# EAGLE design sparrow-though-jack (EAGLE 6.1)
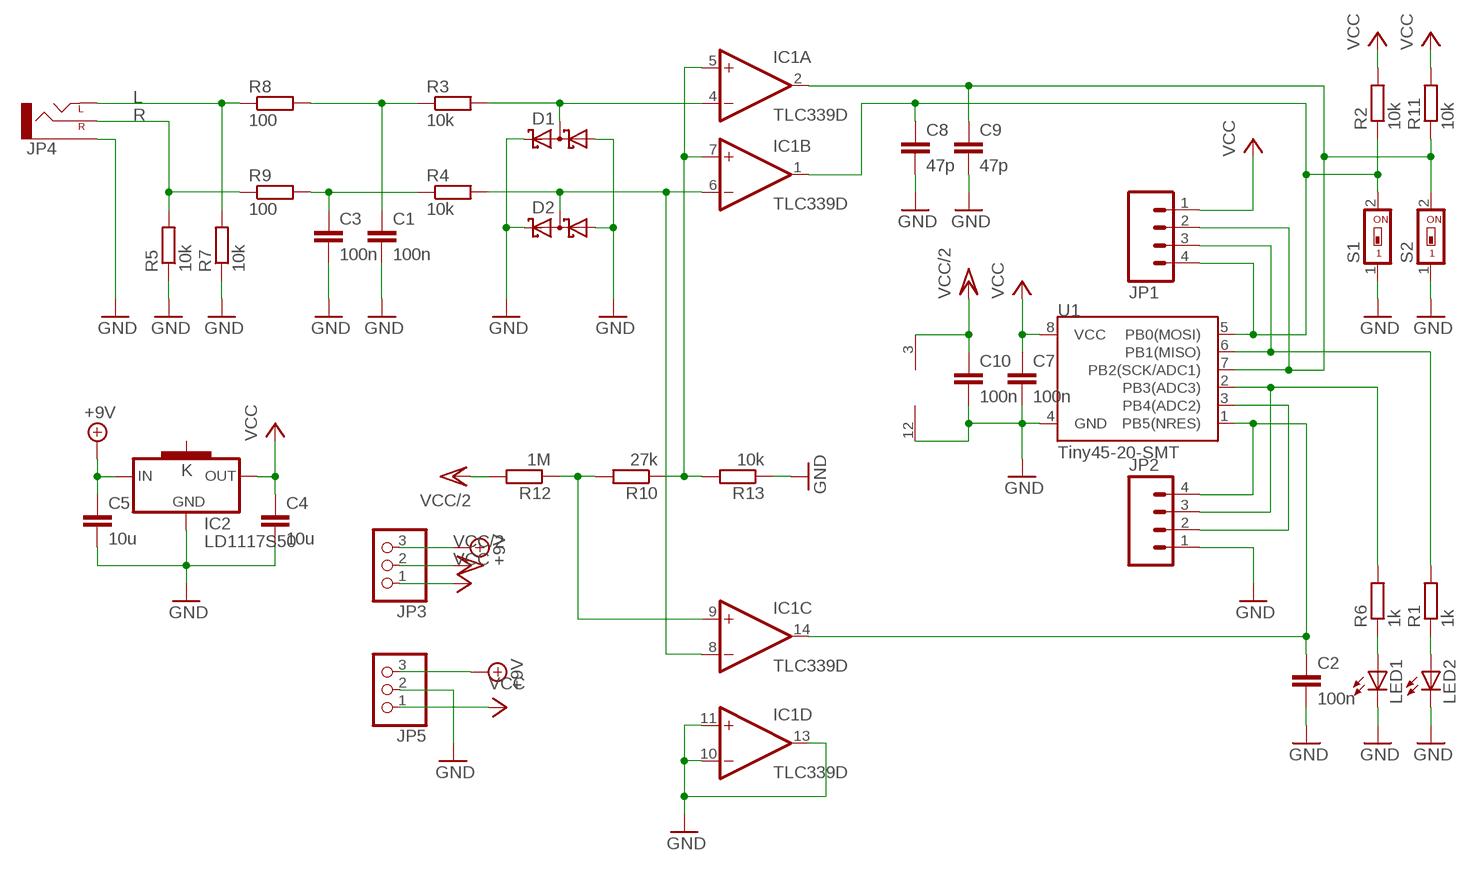
[diagram p0: schematic, sheet 1]

## Parts
C1  100n  C-EUC0805K  [C0805K]
C2  100n  C-EUC0805K  [C0805K]
C3  100n  C-EUC0805K  [C0805K]
C4  10u  C-EUC0805K  [C0805K]
C5  10u  C-EUC0805K  [C0805K]
C7  100n  C-EUC0805K  [C0805K]
C8  47p  C-EUC0805K  [C0805K]
C9  47p  C-EUC0805K  [C0805K]
C10  100n  C-EUC0805K  [C0805K]
D1  BAT54S  [SOT23]
D2  BAT54S  [SOT23]
IC1  TLC339D  [SO14]
IC2  LD1117S50  [SOT223]
JP1  M04PTH  [1X04]
JP2  M04PTH  [1X04]
JP3  PINHD-1X3  [1X03]
JP4  AUDIO-JACKPIN-HOLES  [AUDIO-JACK-HOLES]
JP5  PINHD-1X3  [1X03]
LED1  LEDCHIP-LED0805  [CHIP-LED0805]
LED2  LEDCHIP-LED0805  [CHIP-LED0805]
R1  1k  R-EU_M0805  [M0805]
R2  10k  R-EU_M0805  [M0805]
R3  10k  R-EU_M0805  [M0805]
R4  10k  R-EU_M0805  [M0805]
R5  10k  R-EU_M0805  [M0805]
R6  1k  R-EU_M0805  [M0805]
R7  10k  R-EU_M0805  [M0805]
R8  100  R-EU_M0805  [M0805]
R9  100  R-EU_M0805  [M0805]
R10  27k  R-EU_M0805  [M0805]
R11  10k  R-EU_M0805  [M0805]
R12  1M  R-EU_M0805  [M0805]
R13  10k  R-EU_M0805  [M0805]
S1  SWS001  [SMS-001]
S2  SWS001  [SMS-001]
U1  Tiny45-20-SMT  ATTINY45TINY45-20-SMT  [SO08-EIAJ]

## Nets
+9V: C5.1 IC2.3(IN) JP3.3 JP5.3
GND: C1.2 C2.2 C3.2 C4.2 C5.2 C7.2 C8.2 C9.2 C10.2 D1.1(A1) D1.2(C2) D2.1(A1) D2.2(C2) IC1.10(D:-IN) IC1.11(D:+IN) IC1.12(P:V-) IC1.13(D:OUT) IC2.1(GND) JP2.1 JP4.GND(SLEEVE) JP5.2 LED1.C LED2.C R5.1 R7.1 R13.1 S1.1 S2.1 U1.4(GND)
L: JP4.L1-(LEFT) JP4.L2-(LEFT) R7.2 R8.1
N$1: D1.3(C1A2) IC1.4(A:-IN) R3.2
N$2: JP2.3 R6.2 U1.2(PB3(ADC3))
N$3: C2.1 IC1.14(C:OUT) JP2.4 U1.1(PB5(NRES))
N$4: JP2.2 U1.3(PB4(ADC2))
N$6: D2.3(C1A2) IC1.6(B:-IN) IC1.8(C:-IN) R4.2
N$7: JP1.3 R1.2 U1.6(PB1(MISO))
N$8: C9.1 IC1.2(A:OUT) JP1.2 R11.1 S2.2 U1.7(PB2(SCK/ADC1))
N$9: C1.1 R3.1 R8.2
N$10: LED1.A R6.1
N$11: LED2.A R1.1
N$12: C3.1 R4.1 R9.2
N$13: C8.1 IC1.1(B:OUT) JP1.4 R2.1 S1.2 U1.5(PB0(MOSI))
N$16: IC1.9(C:+IN) R10.2 R12.1
N$17: IC1.5(A:+IN) IC1.7(B:+IN) R10.1 R13.2
R: JP4.R+(RIGHT) R5.2 R9.1
VCC: C4.1 C7.1 IC2.2(OUT) JP1.1 JP3.1 JP5.1 R2.2 R11.2 U1.8(VCC)
VCC/2: C10.1 IC1.3(P:V+) JP3.2 R12.2
Unconnected: IC2.4(K)

## Library data of the parts
C1-C5 C7-C10 = rcl:C-EU: CAPACITOR, European symbol
D1 D2 = diode:BAT54S: Schottky Diodes Pin connection corrected 2011-05-04 Source: Fairchild .. BAT54.pdf
IC1 = linear:TLC339: COMPARATOR
IC2 = mbed-ics:LD1117S50: VOLTAGE REGULATOR SMD 5V
JP1 JP2 = SparkFun-Connectors:M04: Header 4 Standard 4-pin 0.1" header. Use with straight break away headers (SKU : PRT-00116), right angle break away headers (PRT-00553), swiss pins (PRT-00743), machine pins (PRT-00117), and female headers (PRT-00115). Molex polarized connector foot print use with SKU : PRT-08231 with associated crimp pins and housings. 1MM SMD Version SKU: PRT-10208
JP3 JP5 = pinhead:PINHD-1X3: PIN HEADER
JP4 = _MY_OWN_LIB:AUDIO-JACK: 3.5mm Audio Jack Simple 3.5mm common PCB mount audio jack. SKU: PRT-08032
LED1 LED2 = led:LED: LED OSRAM: - CHIPLED LG R971, LG N971, LY N971, LG Q971, LY Q971, LO R971, LY R971 LH N974, LH R974 LS Q976, LO Q976, LY Q976 LO Q996 - Hyper CHIPLED LW Q18S LB Q993, LB Q99A, LB R99A - SideLED LS A670, LO A670, LY A670, LG A670, LP A670 LB A673, LV A673, LT A673, LW A673 LH A674 LY A675 LS A676, LA A676, LO A676, LY A676, LW A676 LS A679, LY A679, LG A679 - Hyper Micro SIDELED® LS Y876, LA Y876, LO Y876, LY Y876 LT Y87S - SmartLED LW L88C, LW L88S LB L89C, LB L89S, LG L890 LS L89K, LO L89K, LY L89K LS L896, LA L896, LO L896, LY L896 - TOPLED LS T670, LO T670, LY T670, LG T670, LP T670 LSG T670, LSP T670, LSY T670, LOP T670, LYG T670 LG T671, LOG T671, LSG T671 LB T673, LV T673, LT T673, LW T673 LH T674 LS T676, LA T676, LO T676, LY T676, LB T676, LH T676, LSB T676, LW T676 LB T67C, LV T67C, LT T67C, LS T67K, LO T67K, LY T67K, LW E67C LS E67B, LA E67B, LO E67B, LY E67B, LB E67C, LV E67C, LT E67C LW T67C LS T679, LY T679, LG T679 LS T770, LO T770, LY T770, LG T770, LP T770 LB T773, LV T773, LT T773, LW T773 LH T774 LS E675, LA E675, LY E675, LS T675 LS T776, LA T776, LO T776, LY T776, LB T776 LHGB T686 LT T68C, LB T68C - Hyper Mini TOPLED® LB M676 - Mini TOPLED Santana® LG M470 LS M47K, LO M47K, LY M47K Source: http://www.osram.convergy.de LUXEON: - LUMILED® LXK2-PW12-R00, LXK2-PW12-S00, LXK2-PW14-U00, LXK2-PW14-V00 LXK2-PM12-R00, LXK2-PM12-S00, LXK2-PM14-U00 LXK2-PE12-Q00, LXK2-PE12-R00, LXK2-PE12-S00, LXK2-PE14-T00, LXK2-PE14-U00 LXK2-PB12-K00, LXK2-PB12-L00, LXK2-PB12-M00, LXK2-PB14-N00, LXK2-PB14-P00, LXK2-PB14-Q00 LXK2-PR12-L00, LXK2-PR12-M00, LXK2-PR14-Q00, LXK2-PR14-R00 LXK2-PD12-Q00, LXK2-PD12-R00, LXK2-PD12-S00 LXK2-PH12-R00, LXK2-PH12-S00 LXK2-PL12-P00, LXK2-PL12-Q00, LXK2-PL12-R00 Source: www.luxeon.com KINGBRIGHT: KA-3528ASYC Source: www.kingbright.com
R1-R13 = rcl:R-EU_: RESISTOR, European symbol
S1 S2 = smd-special:SWS001: SMD Dip Switch 1 pol.
U1 = SparkFun-DigitalIC:ATTINY45: Atmel 8-pin 2/4/8kB flash uC; PROD_ID: IC-08922

## Board
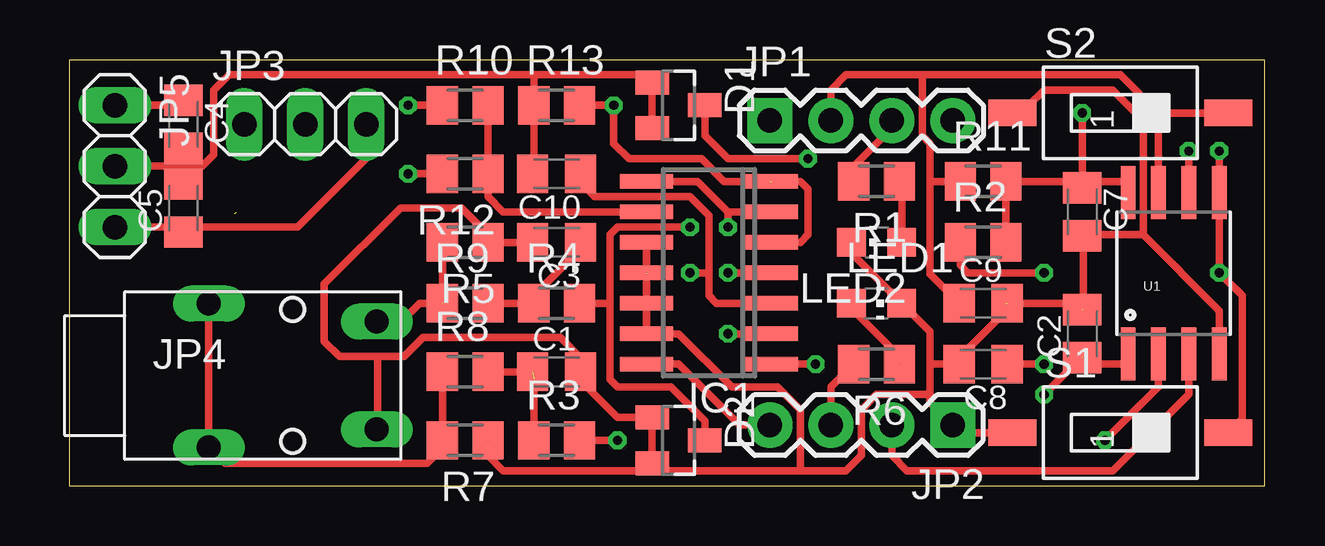
[diagram p1: board, top side]
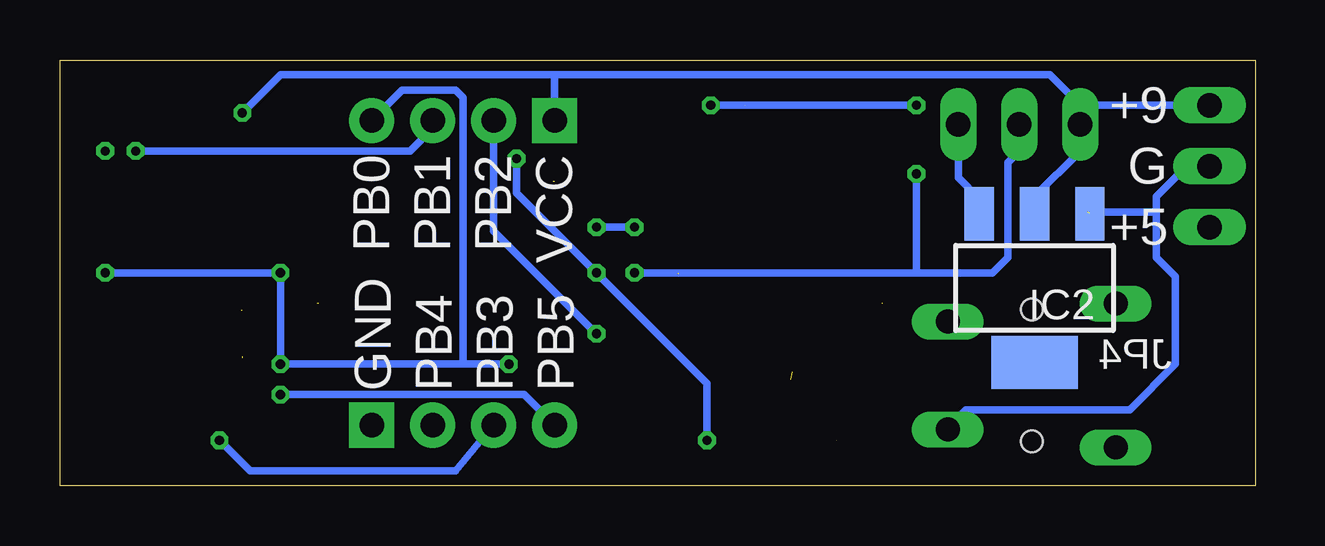
[diagram p2: board, bottom side, seen from below]

Size 49.83 x 17.77 mm. Coordinates in mm from the lower left corner, seen from the top.
Outline: 0,0 49.83,0 49.83,17.77 0,17.77 0,0
Copper layers (1*16): Top 0.0356mm / dielectric 1.5011mm / Bottom 0.0356mm
Design rules: minimum track width 6mil, minimum drill 13mil, track to track 6mil, track to pad 6mil, pad to pad 6mil, via to via 6mil, smd to smd 6mil, copper to edge 15mil, drill to drill 6mil, minimum pad ring 7mil, minimum via ring 7mil, stop-mask expansion 3mil, vias tented up to drill 0mil, thermal gap 10mil

### Footprints (pad centres in the part's own frame; a part is rotated, then mirrored left to right if it is on the bottom)
C0805K = smd 1.3 x 1.6: 1 -1,0; 2 1,0
SOT23 = smd 1 x 1.4: 1 -0.95,-1.1; 2 0.95,-1.1; 3 0,1.1
SO14 = smd 0.6 x 2.2: 1 -3.81,-2.6; 2 -2.54,-2.6; 3 -1.27,-2.6; 4 0,-2.6; 5 1.27,-2.6; 6 2.54,-2.6; 7 3.81,-2.6; 8 3.81,2.6; 9 2.54,2.6; 10 1.27,2.6; 11 0,2.6; 12 -1.27,2.6; 13 -2.54,2.6; 14 -3.81,2.6
SOT223 = smd 1.219 x 2.235: 1 -2.311,-3.099; 2 0,-3.099; 3 2.311,-3.099 | smd 3.6 x 2.2: 4 0,3.099
1X04 = drill 1.016 pad 1.88 square: 1 0,0 | drill 1.016 pad 1.88: 2 2.54,0; 3 5.08,0; 4 7.62,0
1X03 = drill 1.016 long: 1 -2.54,0; 2 0,0; 3 2.54,0
AUDIO-JACK-HOLES = drill 1 pad 1.32 long: GND 6,-2.25; L1- -1,-3; L2- -1,3; R+ 6,2.25 | hole 0.9: 2.5,2.75; 2.5,-2.75
CHIP-LED0805 = smd 1.2 x 1.2: A 0,-1.05; C 0,1.05
M0805 = smd 1.3 x 1.6: 1 -0.95,0; 2 0.95,0
SMS-001 = smd 1.092 x 2.007: 1 0,-4.496; 2 0,4.496
SO08-EIAJ = smd 0.61 x 2.21: 1 -1.905,-3.378; 2 -0.635,-3.378; 3 0.635,-3.378; 4 1.905,-3.378; 5 1.905,3.353; 6 0.635,3.353; 7 -0.635,3.353; 8 -1.905,3.353

### Placement (x,y rotation side)
C1  20.32,4.76 0 top
C2  42.23,6.35 90 top
C3  20.32,10.16 180 top
C4  4.76,15.08 270 top
C5  4.76,11.59 90 top
C7  42.23,11.43 270 top
C8  38.1,5.08 180 top
C9  38.1,7.62 0 top
C10  20.32,13.02 180 top
D1  25.4,15.88 270 top
D2  25.4,1.91 270 top
IC1  26.67,8.89 90 top
IC2  9.21,8.26 180 bottom
JP1  29.21,15.24 0 top
JP2  36.83,2.54 180 top
JP3  9.84,15.08 0 top
JP4  6.83,4.6 0 top
JP5  1.91,13.34 270 top
LED1  33.66,7.62 270 top
LED2  33.66,10.16 90 top
R1  33.66,12.7 180 top
R2  38.1,10.16 0 top
R3  20.32,1.91 0 top
R4  20.32,7.62 0 top
R5  16.51,10.16 180 top
R6  33.66,5.08 180 top
R7  16.51,1.91 180 top
R8  16.51,4.76 0 top
R9  16.51,7.62 0 top
R10  16.51,15.88 0 top
R11  38.1,12.7 0 top
R12  16.51,13.02 180 top
R13  20.32,15.88 0 top
S1  43.82,2.22 270 top
S2  43.82,15.56 270 top
U1  46.04,8.89 0 top

### Tracks (layer width: path | path; a pad name or v marks a point on that pad's centre or on a via)
+9V
  Top 0.305: JP5.3 4.13,10.79 4.13,10.75 C5.1 4.45,10.79 9.53,10.79 12.38,13.65 JP3.3
  Bottom 0.305: IC2.3 11.52,11.99 12.38,12.86 JP3.3
GND  (5 unrouted)
  Top 0.305: S2.1 40.01,15.88 40.64,16.51 43.5,16.51 44.77,15.24 44.77,10.48 | 44.77,10.48 47.94,7.3 U1.4 | 35.88,3.81 33.65,3.81 33.02,3.17 33.02,1.27 32.38,0.64 30.48,0.64 | 35.88,5.08 35.88,6.45 LED1.C 32.8,9.53 LED2.C | 35.88,5.08 35.88,3.81 | C7.2 42.27,10.43 | 35.88,5.08 C8.2 37.42,5.62 37.42,5.67 39.05,7.3 39.05,7.62 | 42.27,7.62 C9.2 | 42.27,10.43 42.27,10.48 44.77,10.48 | 42.27,10.43 42.27,7.62 | 42.27,7.62 42.27,7.35 42.23,7.3 | 21.27,5.03 C1.2 | R7.1 | R5.1 | 24.13,15.24 24.3,15.07 D1.2 D1.1 23.98,17.14 13.97,17.14 | 19.37,13.34 19.37,12.75 C10.2 19.37,13.07 R13.1 19.37,17.14 13.97,17.14 | C3.2 R5.1 | R5.1 17.46,10.48 16.35,11.59 13.81,11.59 10.64,8.41 10.64,6.03 11.27,5.4 12.86,5.4 | 13.97,17.14 6.67,17.14 6.03,16.51 6.03,13.81 5.56,13.34 4.76,13.34 | 4.45,12.38 C5.2 4.76,13.34 | JP5.2 4.76,13.34 | 35.88,3.81 35.88,3.49 JP2.1 37.15,2.22 S1.1 | C1.2 21.32,5.35 20.48,6.19 14.76,6.19 13.97,5.4 12.86,5.4 | C1.2 21.32,4.4 22.86,2.86 24.13,2.86 24.13,2.85 D2.1 D2.2 24.3,0.81 24.13,0.64 | 30.48,0.64 24.13,0.64 | 24.13,0.64 18.1,0.64 17.46,1.27 R7.1 | 30.48,0.64 30.48,3.17 29.53,4.13 27.62,4.13 25.4,6.35 24.13,6.35 | 4.76,13.34 C4.2 | 24.13,8.89 24.07,8.83 IC1.12 24.07,6.41 24.13,6.35 | IC1.11 IC1.10 | IC1.13 24.13,6.35 | 12.86,5.4 12.86,2.38 12.85,2.38 JP4.GND
  Bottom 0.305: 4.13,11.43 4.13,12.06 2.86,13.34 JP5.2 | 4.13,11.43 6.98,11.43 | 4.13,11.43 4.13,9.53 3.33,8.73 3.33,5.08 5.24,3.17 12.07,3.17 12.83,2.41 JP4.GND
L
  Top 0.305: R8.1 R7.2 15.56,1.59 14.92,0.95 6.51,0.95 5.99,1.48 5.95,1.48 JP4.L1- 5.86,1.6 | JP4.L2- 5.83,1.64 5.86,1.6 | 5.86,1.6 5.87,1.59
N$1  (via drill 0.38)
  Top 0.305: D1.3 26.5,14.62 27.46,13.65 v30.8,13.65 | v27.46,8.89 IC1.4 | v22.86,1.91 R3.2
  Bottom 0.305: v30.8,13.65 30.8,12.22 v27.46,8.89 22.86,4.29 v22.86,1.91
N$2  (via drill 0.38)
  Top 0.305: 32.39,5.72 R6.2 31.75,4.12 JP2.3 | v43.18,1.91 45.4,4.13 U1.2
  Bottom 0.305: JP2.3 33.34,0.64 41.91,0.64 v43.18,1.91
N$3  (via drill 0.38)  (1 unrouted)
  Top 0.305: U1.1 44.13,5.08 42.27,5.08 C2.1 | IC1.14 25.4,5.08 27.94,2.54 JP2.4 | v40.64,3.81 42.23,5.4
  Bottom 0.305: v40.64,3.81 30.48,3.81 JP2.4
N$4
  Top 0.305: JP2.2 34.29,1.27 34.92,0.64 43.5,0.64 46.67,3.81 U1.3
N$6  (via drill 0.38)
  Top 0.305: IC1.6 27.46,11.43 | IC1.8 26.19,12.7 27.46,11.43 | D2.3 26.5,2.71 25.08,4.13 22.86,4.13 22.54,4.45 22.54,7.62 | 22.54,7.62 22.54,10.48 22.86,10.79 v25.88,10.79 | R4.2 22.54,7.62 | 27.46,11.43 v27.46,10.79
  Bottom 0.305: v25.88,10.79 v27.46,10.79
N$7  (via drill 0.38)
  Top 0.305: R1.2 32.7,13.34 34.29,14.92 JP1.3 | U1.6 v46.67,13.97
  Bottom 0.305: v46.67,13.97 35.24,13.97 34.29,14.92 JP1.3
N$8  (via drill 0.38)
  Top 0.305: U1.7 45.4,15.56 | JP1.2 31.75,16.51 32.38,17.14 35.56,17.14 | 35.56,17.14 43.82,17.14 45.4,15.56 | 35.56,14.61 35.56,17.14 | 35.56,14.61 | IC1.2 v27.46,6.35 | 35.56,14.61 35.88,14.29 35.88,12.7 | 35.88,12.7 35.88,8.84 C9.1 | R11.1 35.88,12.7 | S2.2 45.4,15.56
  Bottom 0.305: v27.46,6.35 31.75,10.64 JP1.2
N$9  (1 unrouted)
  Top 0.305: R3.1 19.37,4.44 19.37,4.45 | R8.2 C1.1
N$10  (1 unrouted)
  Top 0.305: LED1.A 32.6,7.4 34.61,5.4 R6.1
N$11
  Top 0.305: LED2.A 34.7,12.28 R1.1
N$12
  Top 0.305: R9.2 R4.1 19.37,7.94 20.95,9.53 20.95,9.79 C3.1
N$13  (via drill 0.38)
  Top 0.305: S1.2 48.9,2.81 48.9,7.94 v47.94,8.89 U1.5 v47.94,13.97 | IC1.1 v31.11,5.08 | 37.15,9.21 R2.1 37.15,9.21 | 37.15,9.21 37.47,8.89 v40.64,8.89 | v40.64,5.08 C8.1 39.05,5.08
  Bottom 0.305: v31.11,5.08 33.02,5.08 | 33.02,5.08 v40.64,5.08 v40.64,8.89 v47.94,8.89 | JP1.4 35.56,16.51 33.34,16.51 33.02,16.19 33.02,5.08
N$16
  Top 0.305: IC1.9 18.1,11.43 17.46,12.07 R12.1 R10.2
N$17  (via drill 0.38)  (2 unrouted)
  Top 0.305: IC1.5 30.48,10.16 30.8,10.48 30.8,12.38 30.48,12.7 IC1.7 | 29.21,12.7 27.31,12.7 26.35,13.65 23.34,13.65 22.7,14.29 v22.7,15.88 R13.2 | v14.13,15.88 R10.1
  Bottom 0.305: v22.7,15.88 v14.13,15.88
R  (1 unrouted)
  Top 0.305: R5.2 R9.1 14.61,7.62 13.84,6.85 JP4.R+
VCC  (via drill 0.38)
  Top 0.305: R2.2 R11.2 42.86,12.7 | JP5.1 4.4,15.88 C4.1 | 42.86,12.7 44.13,12.7 U1.8 | v42.23,15.56 C7.1 42.82,12.43 42.86,12.7
  Bottom 0.305: v42.23,15.56 40.64,17.14 29.21,17.14 | JP1.1 29.21,17.14 | 29.21,17.14 8.57,17.14 7.3,15.88 | JP5.1 7.3,15.88 | 7.3,15.88 JP3.1 7.3,13.97 9.21,12.06 IC2.2
VCC/2  (via drill 0.38)
  Top 0.305: C10.1 21.32,12.65 21.91,12.06 25.88,12.06 26.67,11.27 26.67,8.89 | 26.67,8.89 26.67,7.94 26.99,7.62 IC1.3 | v25.88,8.89 26.67,8.89 | R12.2 v14.13,13.02
  Bottom 0.305: 14.13,8.89 v25.88,8.89 | v14.13,13.02 14.13,8.89 | 14.13,8.89 10.95,8.89 10.32,9.53 10.32,13.49 9.84,13.97 JP3.2

### Text on the board
bPlace: +9 | G | VCC | PB2 | PB1 | PB0 | +5 | PB5 | PB3 | PB4 | GND